# Altium schematic sheet IB_V2_OverView.SchDoc
size A3; SheetNumber: 1; SheetTotal: 5
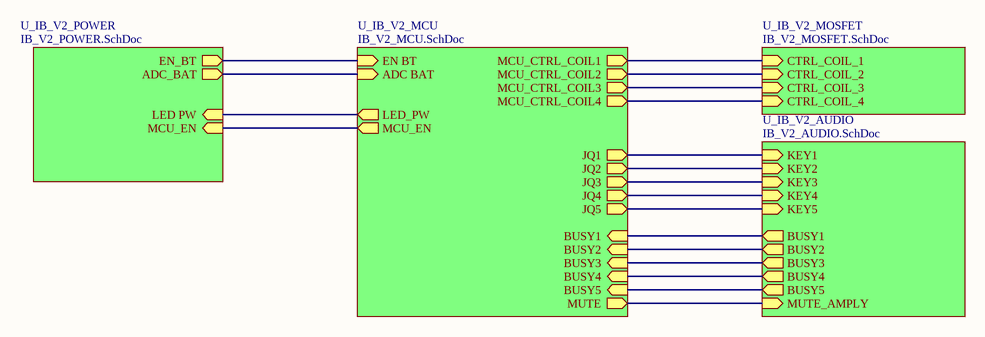
[diagram p0: IB_V2_OverView.SchDoc]

## Sub-sheets
U_IB_V2_AUDIO = IB_V2_AUDIO.SchDoc: KEY1 (in), KEY2 (in), KEY3 (in), KEY4 (in), KEY5 (in), BUSY1 (out), BUSY2 (out), BUSY3 (out), BUSY4 (out), BUSY5 (out), MUTE_AMPLY (in)
U_IB_V2_MCU = IB_V2_MCU.SchDoc: LED_PW (out), MCU_EN (out), EN BT (in), ADC BAT (in), MCU_CTRL_COIL1 (out), MCU_CTRL_COIL2 (out), BUSY1 (in), BUSY2 (in), BUSY3 (in), BUSY4 (in), BUSY5 (in), JQ1 (out), JQ2 (out), JQ3 (out), JQ4 (out), JQ5 (out), MUTE (out), MCU_CTRL_COIL3 (out), MCU_CTRL_COIL4 (out)
U_IB_V2_MOSFET = IB_V2_MOSFET.SchDoc: CTRL_COIL_1 (in), CTRL_COIL_2 (in), CTRL_COIL_3 (in), CTRL_COIL_4 (in)
U_IB_V2_POWER = IB_V2_POWER.SchDoc: EN_BT (out), ADC_BAT (out), MCU_EN (in), LED PW (in)

## Nets
(unnamed): sheet U_IB_V2_AUDIO/KEY1, sheet U_IB_V2_MCU/JQ1
(unnamed): sheet U_IB_V2_AUDIO/KEY2, sheet U_IB_V2_MCU/JQ2
(unnamed): sheet U_IB_V2_AUDIO/KEY3, sheet U_IB_V2_MCU/JQ3
(unnamed): sheet U_IB_V2_AUDIO/KEY4, sheet U_IB_V2_MCU/JQ4
(unnamed): sheet U_IB_V2_AUDIO/KEY5, sheet U_IB_V2_MCU/JQ5
(unnamed): sheet U_IB_V2_AUDIO/BUSY1, sheet U_IB_V2_MCU/BUSY1
(unnamed): sheet U_IB_V2_AUDIO/BUSY2, sheet U_IB_V2_MCU/BUSY2
(unnamed): sheet U_IB_V2_AUDIO/BUSY3, sheet U_IB_V2_MCU/BUSY3
(unnamed): sheet U_IB_V2_AUDIO/BUSY4, sheet U_IB_V2_MCU/BUSY4
(unnamed): sheet U_IB_V2_AUDIO/BUSY5, sheet U_IB_V2_MCU/BUSY5
(unnamed): sheet U_IB_V2_AUDIO/MUTE_AMPLY, sheet U_IB_V2_MCU/MUTE
(unnamed): sheet U_IB_V2_MCU/LED_PW, sheet U_IB_V2_POWER/LED PW
(unnamed): sheet U_IB_V2_MCU/MCU_EN, sheet U_IB_V2_POWER/MCU_EN
(unnamed): sheet U_IB_V2_MCU/EN BT, sheet U_IB_V2_POWER/EN_BT
(unnamed): sheet U_IB_V2_MCU/ADC BAT, sheet U_IB_V2_POWER/ADC_BAT
(unnamed): sheet U_IB_V2_MCU/MCU_CTRL_COIL1, sheet U_IB_V2_MOSFET/CTRL_COIL_1
(unnamed): sheet U_IB_V2_MCU/MCU_CTRL_COIL2, sheet U_IB_V2_MOSFET/CTRL_COIL_2
(unnamed): sheet U_IB_V2_MCU/MCU_CTRL_COIL3, sheet U_IB_V2_MOSFET/CTRL_COIL_3
(unnamed): sheet U_IB_V2_MCU/MCU_CTRL_COIL4, sheet U_IB_V2_MOSFET/CTRL_COIL_4